# EAGLE design UMR2 CS01 ADAPTER (EAGLE 6.6.0)
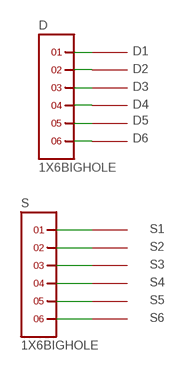
[diagram p0: schematic, sheet 1]

## Parts
D  1X6BIGHOLE  [1X6]
D1  SMD_PAD  [SMDPAD_1X2]
D2  SMD_PAD  [SMDPAD_1X2]
D3  SMD_PAD  [SMDPAD_1X2]
D4  SMD_PAD  [SMDPAD_1X2]
D5  SMD_PAD  [SMDPAD_1X2]
D6  SMD_PAD  [SMDPAD_1X2]
S  1X6BIGHOLE  [1X6]
S1  SMD_PAD  [SMDPAD_1X2]
S2  SMD_PAD  [SMDPAD_1X2]
S3  SMD_PAD  [SMDPAD_1X2]
S4  SMD_PAD  [SMDPAD_1X2]
S5  SMD_PAD  [SMDPAD_1X2]
S6  SMD_PAD  [SMDPAD_1X2]

## Nets
N$1: D1.P$1(>NAME) D.1
N$2: D2.P$1(>NAME) D.2
N$3: D3.P$1(>NAME) D.3
N$4: D4.P$1(>NAME) D.4
N$5: D5.P$1(>NAME) D.5
N$6: D6.P$1(>NAME) D.6
N$7: S1.P$1(>NAME) S.1
N$8: S2.P$1(>NAME) S.2
N$9: S3.P$1(>NAME) S.3
N$10: S4.P$1(>NAME) S.4
N$11: S5.P$1(>NAME) S.5
N$12: S6.P$1(>NAME) S.6

## Library data of the parts
D S = headers(.1in):1X6
D1-D6 S1-S6 = 0Raph's Lib:SMD_PAD

## Board
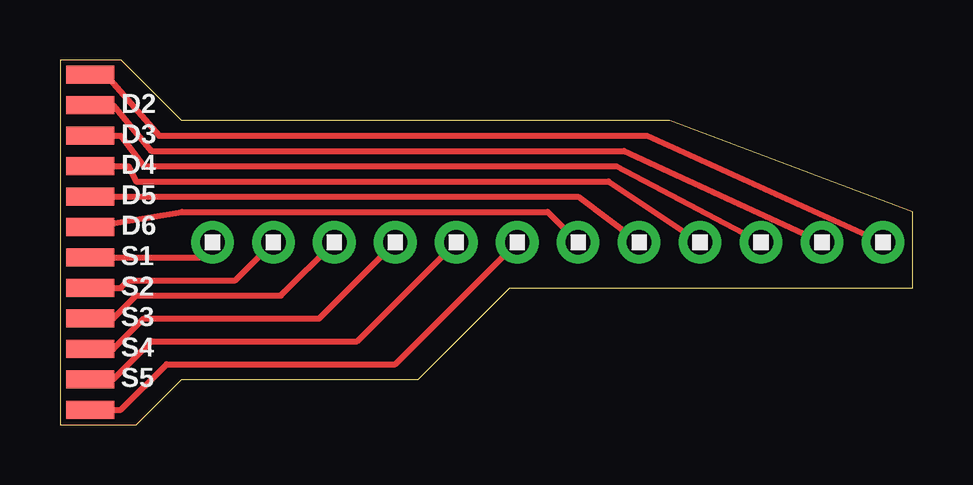
[diagram p1: board, top side]

Size 35.54 x 15.23 mm. Coordinates in mm from the lower left corner, seen from the top.
Outline: 0,0 3.17,0 5.08,1.91 14.92,1.91 18.73,5.71 35.54,5.71 35.54,8.88 25.4,12.7 5.08,12.7 2.55,15.23 0,15.23 0,0
Copper layers (1*16): Top 0.035mm / dielectric 1.5mm / Bottom 0.035mm
Design rules "default": minimum track width 10mil, minimum drill 24mil, track to track 8mil, track to pad 8mil, pad to pad 8mil, via to via 8mil, smd to smd 8mil, copper to edge 40mil, drill to drill 8mil, minimum pad ring 10mil, minimum via ring 8mil, stop-mask expansion 4mil, vias tented up to drill 25mil, thermal gap 10mil

### Footprints (pad centres in the part's own frame; a part is rotated, then mirrored left to right if it is on the bottom)
1X6 = drill 1.016 pad 1.778: 1 0,0; 2 2.54,0; 3 5.08,0; 4 7.62,0; 5 10.16,0; 6 12.7,0
SMDPAD_1X2 = smd 2 x 0.75: P$1 0,0

### Placement (x,y rotation side)
D  34.29,7.62 180 top
D1  1.27,14.61 0 top
D2  1.27,13.34 0 top
D3  1.27,12.06 0 top
D4  1.27,10.79 0 top
D5  1.27,9.53 0 top
D6  1.27,8.26 0 top
S  6.35,7.62 0 top
S1  1.27,6.99 0 top
S2  1.27,5.71 0 top
S3  1.27,4.45 0 top
S4  1.27,3.17 0 top
S5  1.27,1.91 0 top
S6  1.27,0.64 0 top

### Tracks (layer width: path | path; a pad name or v marks a point on that pad's centre or on a via)
N$1
  Top 0.254: D1.P$1 1.91,14.61 4.13,12.06 24.45,12.06 D.1
N$2
  Top 0.254: D2.P$1 2.22,13.34 3.81,11.43 23.5,11.43 D.2
N$3
  Top 0.254: D3.P$1 2.54,12.06 3.49,10.79 23.18,10.79 D.3
N$4
  Top 0.254: D4.P$1 2.86,10.79 3.17,10.16 22.86,10.16 D.4
N$5
  Top 0.254: D5.P$1 21.59,9.53 D.5
N$6
  Top 0.254: D6.P$1 5.08,8.89 20.32,8.89 D.6
N$7
  Top 0.254: S1.P$1 5.71,6.99 arc90 S.1
N$8
  Top 0.254: S2.P$1 2.54,5.71 2.86,6.03 7.3,6.03 S.2
N$9
  Top 0.254: S3.P$1 2.22,4.45 3.17,5.4 9.21,5.4 S.3
N$10
  Top 0.254: S4.P$1 2.22,3.17 3.49,4.45 10.79,4.45 S.4
N$11
  Top 0.254: S5.P$1 2.22,1.91 3.81,3.49 12.38,3.49 S.5
N$12
  Top 0.254: S6.P$1 2.54,0.64 4.45,2.54 13.97,2.54 S.6

### Text on the board
tPlace: D2 | D3 | D4 | D5 | D6 | S1 | S2 | S3 | S4 | S5